# Altium schematic sheet sheet_symbol_input.SchDoc
size A
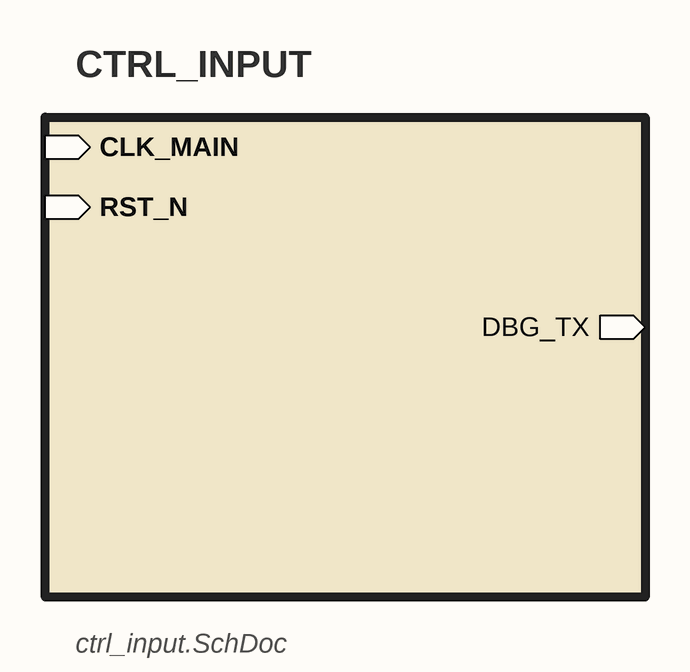
[diagram p0: sheet_symbol_input.SchDoc]

## Sub-sheets
CTRL_INPUT = ctrl_input.SchDoc: CLK_MAIN (in), RST_N (in), DBG_TX (out)